# EasyEDA schematic BusRaider 2.01.json
TITLE: Bus Raider for RC2014; REV: 2.0; Date: 2019-10-06; Sheet: 1/1; Drawn By: robdobsn
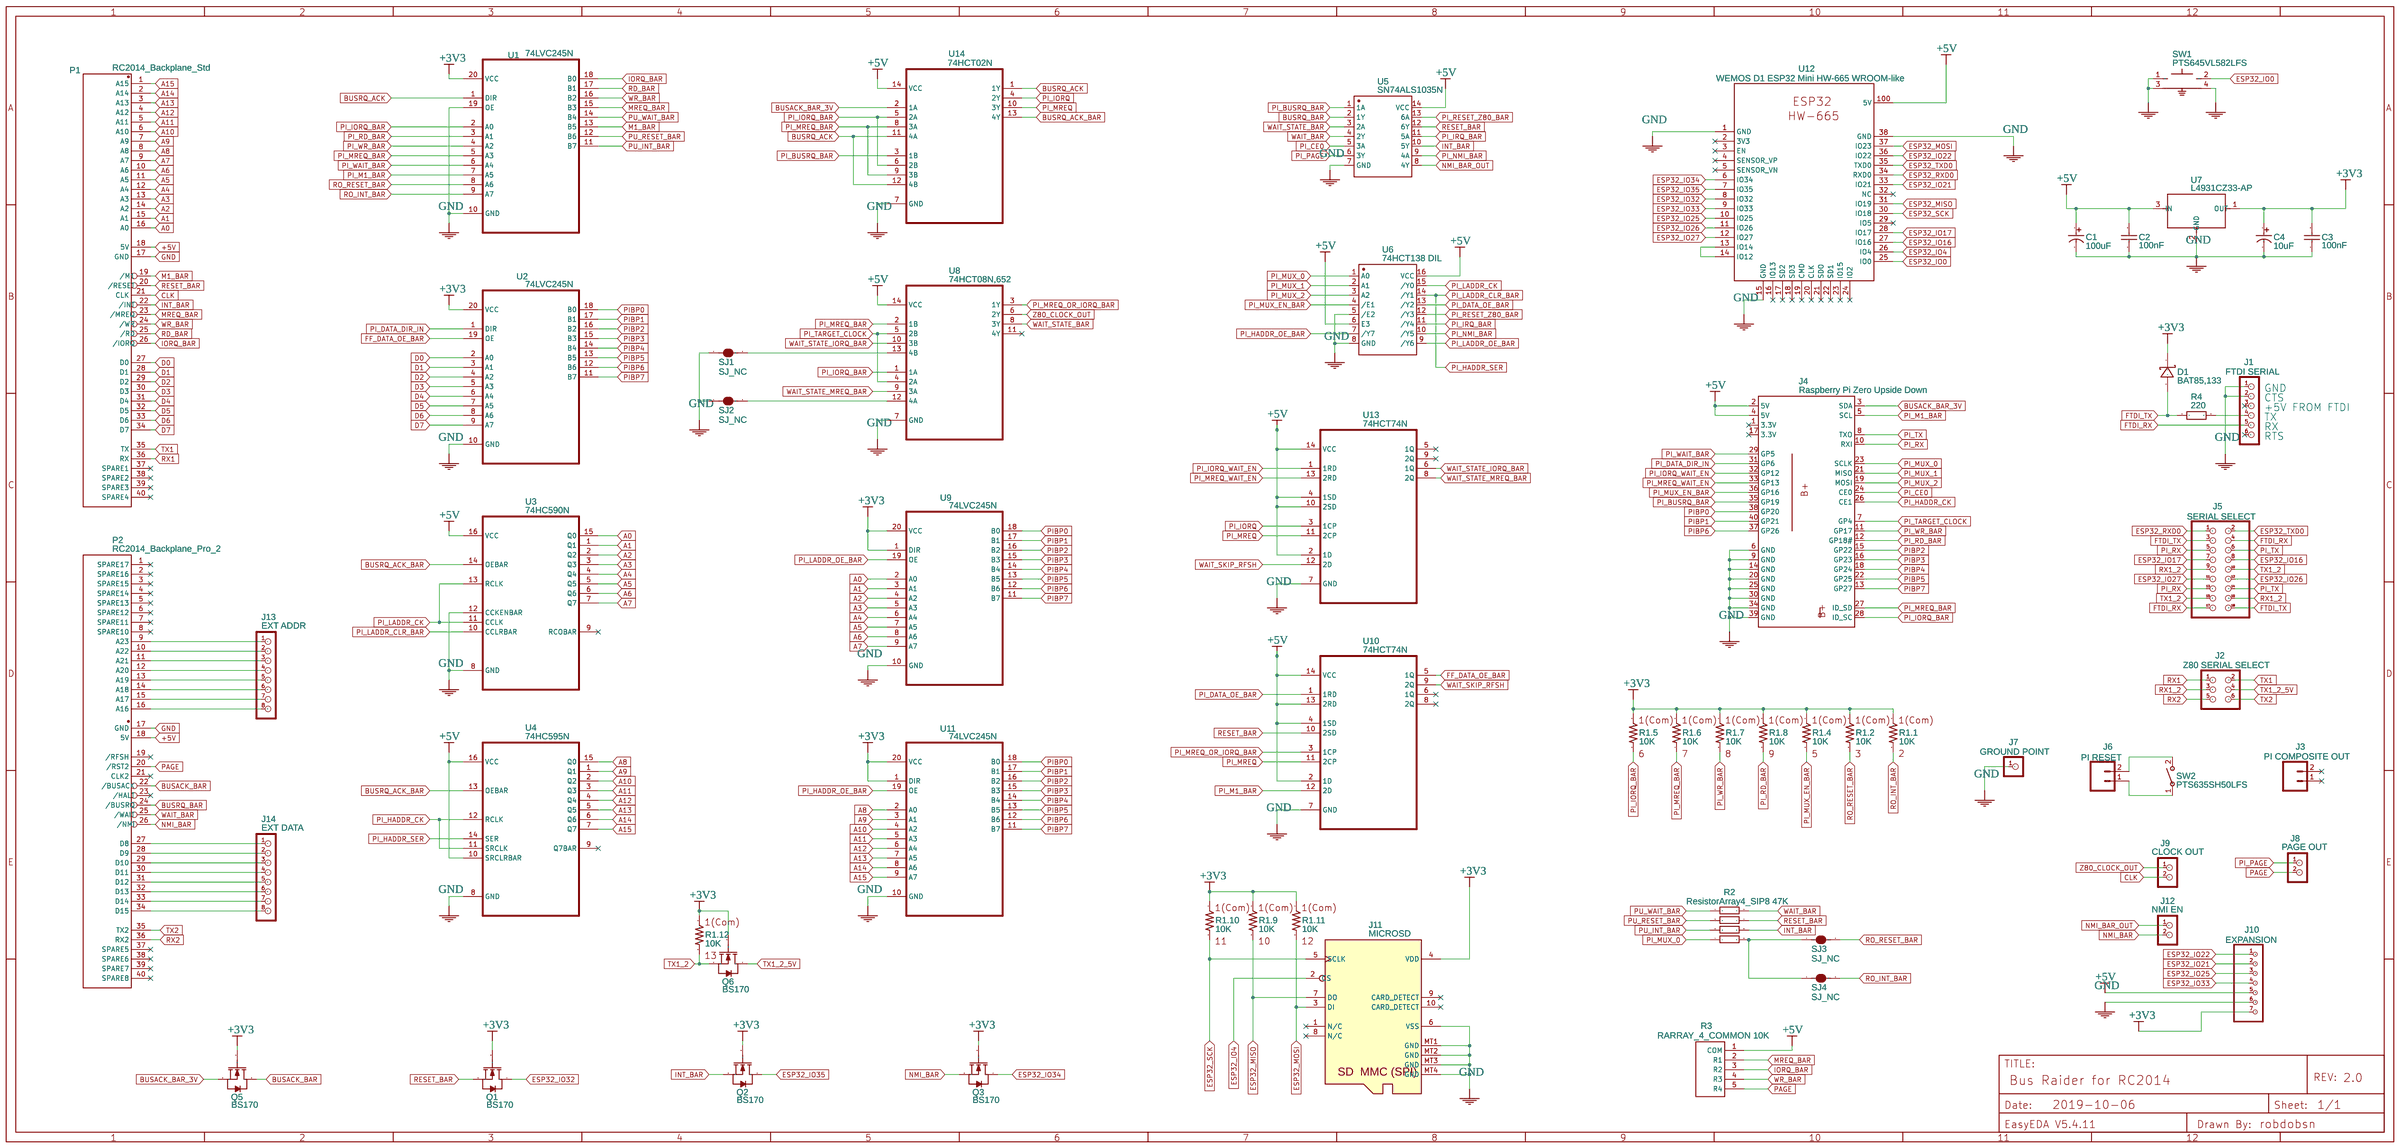
[diagram p0: schematic sheet]

## Parts
C1  100uF  [CAP-TH_BD5.0-P2.00-D0.8-FD]
C2  100nF  [PKG-CERAMIC CAPACITOR 6X2]
C3  100nF  [PKG-CERAMIC CAPACITOR 6X2]
C4  10uF  [CAP-TH_BD5.0-P2.00-D0.8-FD]
D1  BAT85,133  [DO-34-F]
J1  FTDI SERIAL  [M1X6]
J2  Z80 SERIAL SELECT  [2X03_NO_SILK]
J3  PI COMPOSITE OUT  [1X02_NO_SILK]
J4  Raspberry Pi Zero Upside Down  [PI_ZERO_UPSIDE_DOWN_3_HOLE_OPP]
J5  SERIAL SELECT  [2X09-CLEANBIG]
J6  PI RESET  [1X02_NO_SILK]
J7  GROUND POINT  [M1X2_10_17]
J8  PAGE OUT  [1X02_NO_SILK]
J9  CLOCK OUT  [1X02_NO_SILK]
J10  EXPANSION  [1X07_NO_SILK]
J11  MICROSD  [MOLEX SD-503398-003-2]
J12  NMI EN  [1X02_NO_SILK]
J13  EXT ADDR  [1X08_HEADER_2_54_THRU_NO_SILK]
J14  EXT DATA  [1X08_HEADER_2_54_THRU_NO_SILK]
P1  RC2014_Backplane_Std  [HDR-2.54-1X40P]
P2  RC2014_Backplane_Pro_2  [HDR-2.54-1X40P]
Q1  BS170  [TO-92]
Q2  BS170  [TO-92]
Q3  BS170  [TO-92]
Q5  BS170  [TO-92]
Q6  BS170  [TO-92]
R1  10K  [RESISTOR_ARRAY_SIP_13]  (sections 1,10,11,12,2,4,5,6,7,8,9)
R2  ResistorArray4_SIP8 47K  [RESISTOR_ARRAY_SIP_8]
R3  RARRAY_4_COMMON 10K  [RARRAY_4_COMMON]
R4  220  [AXIAL-3.2X1.8(1/8W)]
SJ1  SJ_NC  [SJ_NC]
SJ2  SJ_NC  [SJ_NC]
SJ3  SJ_NC  [SJ_NC]
SJ4  SJ_NC  [SJ_NC]
SW1  PTS645VL582LFS  [KEY-TOUCH-DIP-7.5*6.2*5.85]
SW2  PTS635SH50LFS  [KEY-6.0X3.5X3.5]
U1  74LVC245N  [DIP254P762X420-20]
U2  74LVC245N  [DIP254P762X420-20]
U3  74HC590N  [DIP254P762X508-16]
U4  74HC595N  [DIP254P762X508-16]
U5  SN74ALS1035N  [DIP254P762X420-14]
U6  74HCT138 DIL  [DIP254P762X508-16]
U7  L4931CZ33-AP  [TO-92]
U8  74HCT08N,652  [DIP254P762X420-14]
U9  74LVC245N  [DIP254P762X420-20]
U10  74HCT74N  [DIP254P762X420-14]
U11  74LVC245N  [DIP254P762X420-20]
U12  WEMOS D1 ESP32 Mini HW-665 WROOM-like  [WEMOS D1 ESP32]
U13  74HCT74N  [DIP254P762X420-14]
U14  74HCT02N  [DIP254P762X420-14]

## Library data of the parts
C1 C4 = 100uf/10V: Supplier: LCSC; Manufacturer: ValuePro; Supplier Part: C2035
C2 C3 = -: Voltage: 100V; Tolerance: ±20%; Supplier Part: 9411887; Supplier: Element14; Manufacturer Part: MCFYU6104Z6; Contributor: Prof. Ing. F. Scordino; Link: http://www.farnell.com/datasheets/296858.pdf?_ga=2.179112227.664711881.1510158588-238689616.1505921947&_gac=1.162203016.1510158588.EAIaIQobChMIqoD3jrOv1wIVgwrTCh2CCwl7EAAYASAAEgKQo_D_BwE
D1 = -: Supplier: LCSC; Manufacturer: Nexperia; Contributor: LCSC; Supplier Part: C134301
J1 J7 = -: Contributor: DangerousPrototype
J2 = -: Contributor: DangerousPrototype; sourceId: 5oAa8IGDB
J3 J6 = -: Standard 2-pin 0.1 header. Use with; Contributor: SparkFun
J4 = -: Raspberry Pi B+ GPIO Header; Contributor: robdobsn
J5 = -: PIN HEADER; Contributor: Adafruit
J8 J9 J12 = -: catid: 20; Contributor: DangerousPrototype; sourceId: t7e82kCUO; Manufacturer Part: ?
J10 J13 J14 R2 U5 = -: Contributor: robdobsn
J11 = -: Supplier: Digi-Key; Manufacturer: Molex; Manufacturer part: 5033981892; Manufacturer Part: ?; Supplier Part: WM11190CT-ND
P1 = -: Supplier Part: C74252; Supplier: LCSC; Contributor: robdobsn
P2 = -: Supplier Part: C74252; Contributor: robdobsn
Q1-Q3 Q5 Q6 = -: Supplier: LCSC; Manufacturer: FAIRCHILD; Supplier Part: C111691
R1 = -: Contributor: robdobsn; subpart_no: 12
R3 = -: Manufacturer Part: 4605X-AP1-103LF; Contributor: robdobsn; link: none; Supplier Part: 652-4605X-AP1-103LF; Manufacturer: Bourns
R4 = MF1/8W-160Ω±1% T52: Supplier: LCSC; Supplier Part: C119161; Manufacturer: Chian Chia Elec; Contributor: LCSC
SJ1-SJ4 = -: Solder Jumper; Contributor: robdobsn
SW1 = -: Supplier: LCSC; Supplier Part: C285524; Manufacturer: C&K; Contributor: LCSC
SW2 = -: Supplier: LCSC; Supplier Part: C221866; Manufacturer: C&K; Contributor: LCSC
U1 U2 U9 U11 = -: Octal bus transceiver; Contributor: robdobsn
U3 U4 = -: Octal counter 3 state; Contributor: robdobsn
U6 = -: Supplier Part: C86611; Supplier: LCSC; Manufacturer: FM; Manufacturer Part: 74HC138
U7 = -: DIP PMIC Voltage Regulators LDO 3.3V 250mA;; sourceId: MAoK6rNxT
U8 = -: Quad 2-input NAND gate; Contributor: robdobsn
U10 U13 = -: Dual D-type flip-flop with set and reset positive-edge trigger; Contributor: Guest
U12 = -: Manufacturer: WEMOS; Supplier: WEMOS; Supplier Part: WEMOS_D1_ESP32; Contributor: robdobsn
U14 = -: Quad 2-input NOR gate; Contributor: Guest

## Nets
+3V3: C3.2 C4.1 D1.1(K) J10.7 J11.4(VDD) Q1.2(G) Q2.2(G) Q3.2(G) Q5.2(G) Q6.2(G) R1.1 U1.20(VCC) U2.20(VCC) U7.1(OUT) U9.1(DIR) U9.20(VCC) U11.1(DIR) U11.20(VCC)
+5V: C1.1 C2.2 J4.2(5V) J4.4(5V) J10.5 P1.18(5V) P2.18(5V) R3.1(COM) U3.16(VCC) U4.10(SRCLRBAR) U4.16(VCC) U5.14(VCC) U6.6(E3) U6.16(VCC) U7.3(IN) U8.14(VCC) U10.2(1D) U10.4(1SD) U10.13(2RD) U10.14(VCC) U12.100(5V) U13.2(1D) U13.4(1SD) U13.10(2SD) U13.14(VCC) U14.14(VCC)
GND: C1.2 C2.1 C3.1 C4.2 J1.1 J1.2 J4.6(GND) J4.9(GND) J4.14(GND) J4.20(GND) J4.25(GND) J4.30(GND) J4.34(GND) J4.39(GND) J7.1 J10.6 J11.6(VSS) J11.MT1(GND) J11.MT2(GND) J11.MT3(GND) J11.MT4(GND) P1.17(GND) P2.17(GND) SJ1.1 SJ2.1 SW1.1 SW1.3 SW1.4 U1.10(GND) U1.19(OE) U2.10(GND) U3.8(GND) U3.12(CCKENBAR) U4.8(GND) U5.7(GND) U6.5(/E2) U6.8(GND) U7.2(GND) U8.7(GND) U9.10(GND) U10.7(GND) U11.10(GND) U12.1(GND) U12.15(GND) U12.38(GND) U13.7(GND) U14.7(GND)
A0: P1.16(A0) U3.15(Q0) U9.2(A0)
A1: P1.15(A1) U3.1(Q1) U9.3(A1)
A2: P1.14(A2) U3.2(Q2) U9.4(A2)
A3: P1.13(A3) U3.3(Q3) U9.5(A3)
A4: P1.12(A4) U3.4(Q4) U9.6(A4)
A5: P1.11(A5) U3.5(Q5) U9.7(A5)
A6: P1.10(A6) U3.6(Q6) U9.8(A6)
A7: P1.9(A7) U3.7(Q7) U9.9(A7)
A8: P1.8(A8) U4.15(Q0) U11.2(A0)
A9: P1.7(A9) U4.1(Q1) U11.3(A1)
A10: P1.6(A10) U4.2(Q2) U11.4(A2)
A11: P1.5(A11) U4.3(Q3) U11.5(A3)
A12: P1.4(A12) U4.4(Q4) U11.6(A4)
A13: P1.3(A13) U4.5(Q5) U11.7(A5)
A14: P1.2(A14) U4.6(Q6) U11.8(A6)
A15: P1.1(A15) U4.7(Q7) U11.9(A7)
BUSACK_BAR: P2.22(/BUSACK) Q5.1(D)
BUSACK_BAR_3V: J4.3(SDA) Q5.3(S) U14.2(1A)
BUSRQ_ACK: U1.1(DIR) U14.1(1Y) U14.11(4A) U14.12(4B)
BUSRQ_ACK_BAR: U3.14(OEBAR) U4.13(OEBAR) U14.13(4Y)
BUSRQ_BAR: P2.24(/BUSRQ) U5.2(1Y)
CLK: J9.2 P1.21(CLK)
D0: P1.27(D0) U2.2(A0)
D1: P1.28(D1) U2.3(A1)
D2: P1.29(D2) U2.4(A2)
D3: P1.30(D3) U2.5(A3)
D4: P1.31(D4) U2.6(A4)
D5: P1.32(D5) U2.7(A5)
D6: P1.33(D6) U2.8(A6)
D7: P1.34(D7) U2.9(A7)
ESP32_IO0: SW1.2 U12.25(IO0)
ESP32_IO4: J11.2(CS) U12.26(IO4)
ESP32_IO16: J5.8 U12.27(IO16)
ESP32_IO17: J5.7 U12.28(IO17)
ESP32_IO21: J10.2 U12.33(IO21)
ESP32_IO22: J10.1 U12.36(IO22)
ESP32_IO25: J10.3 U12.10(IO25)
ESP32_IO26: J5.12 U12.11(IO26)
ESP32_IO27: J5.11 U12.12(IO27)
ESP32_IO32: Q1.1(D) U12.8(IO32)
ESP32_IO33: J10.4 U12.9(IO33)
ESP32_IO34: Q3.1(D) U12.6(IO34)
ESP32_IO35: Q2.1(D) U12.7(IO35)
ESP32_MISO: J11.7(DO) R1.10 U12.31(IO19)
ESP32_MOSI: J11.3(DI) R1.12 U12.37(IO23)
ESP32_RXD0: J5.1 U12.34(RXD0)
ESP32_SCK: J11.5(SCLK) R1.11 U12.30(IO18)
ESP32_TXD0: J5.2 U12.35(TXD0)
FF_DATA_OE_BAR: U2.19(OE) U10.5(1Q)
FTDI_RX: J1.5 J5.4 J5.17
FTDI_TX: D1.2(A) J5.3 J5.18 R4.1
INT_BAR: P1.22(/INT) Q2.3(S) R2.6 U5.10(5Y)
IORQ_BAR: P1.26(/IORQ) R3.3(R2) U1.18(B0)
M1_BAR: P1.19(/M1) U1.13(B5)
MREQ_BAR: P1.23(/MREQ) R3.2(R1) U1.15(B3)
NMI_BAR: J12.2 P2.26(/NMI) Q3.3(S)
NMI_BAR_OUT: J12.1 U5.8(4Y)
PAGE: J8.2 P2.20(/RST2) R3.5(R4)
PI_BUSRQ_BAR: J4.35(GP19) U5.1(1A) U14.3(1B)
PI_CE0: J4.24(CE0) U5.5(3A)
PI_DATA_DIR_IN: J4.31(GP6) U2.1(DIR)
PI_DATA_OE_BAR: U6.13(/Y2) U10.1(1RD)
PI_HADDR_CK: J4.26(CE1) U4.11(SRCLK) U4.12(RCLK)
PI_HADDR_OE_BAR: U6.7(/Y7) U11.19(OE)
PI_HADDR_SER: U3.10(CCLRBAR) U4.14(SER) U6.14(/Y1)
PI_IORQ: U13.3(1CP) U14.4(2Y)
PI_IORQ_BAR: J4.28(ID_SC) R1.6 U1.2(A0) U8.1(1A) U14.5(2A) U14.6(2B)
PI_IORQ_WAIT_EN: J4.32(GP12) U13.1(1RD)
PI_IRQ_BAR: U5.11(5A) U6.11(/Y4)
PI_LADDR_CK: U3.11(CCLK) U3.13(RCLK) U6.15(/Y0)
PI_LADDR_OE_BAR: U6.9(/Y6) U9.19(OE)
PI_M1_BAR: J4.5(SCL) U1.7(A5) U10.12(2D)
PI_MREQ: U10.11(2CP) U13.11(2CP) U14.10(3Y)
PI_MREQ_BAR: J4.27(ID_SD) R1.7 U1.5(A3) U8.2(1B) U14.8(3A) U14.9(3B)
PI_MREQ_OR_IORQ_BAR: U8.3(1Y) U10.3(1CP)
PI_MREQ_WAIT_EN: J4.33(GP13) U13.13(2RD)
PI_MUX_0: J4.23(SCLK) R2.7 U6.1(A0)
PI_MUX_1: J4.21(MISO) U6.2(A1)
PI_MUX_2: J4.19(MOSI) U6.3(A2)
PI_MUX_EN_BAR: J4.36(GP16) R1.5 U6.4(/E1)
PI_NMI_BAR: U5.9(4A) U6.10(/Y5)
PI_PAGE: J8.1 U5.6(3Y)
PI_RD_BAR: J4.12(GP18#) R1.9 U1.3(A1)
PI_RESET_Z80_BAR: U5.13(6A) U6.12(/Y3)
PI_RX: J4.10(RXI) J5.5 J5.13
PI_TARGET_CLOCK: J4.7(GP4) U8.4(2A) U8.5(2B)
PI_TX: J4.8(TXO) J5.6 J5.14
PI_WAIT_BAR: J4.29(GP5) U1.6(A4)
PI_WR_BAR: J4.11(GP17) R1.8 U1.4(A2)
PIBP0: J4.38(GP20) U2.18(B0) U9.18(B0) U11.18(B0)
PIBP1: J4.40(GP21) U2.17(B1) U9.17(B1) U11.17(B1)
PIBP2: J4.15(GP22) U2.16(B2) U9.16(B2) U11.16(B2)
PIBP3: J4.16(GP23) U2.15(B3) U9.15(B3) U11.15(B3)
PIBP4: J4.18(GP24) U2.14(B4) U9.14(B4) U11.14(B4)
PIBP5: J4.22(GP25) U2.13(B5) U9.13(B5) U11.13(B5)
PIBP6: J4.37(GP26) U2.12(B6) U9.12(B6) U11.12(B6)
PIBP7: J4.13(GP27) U2.11(B7) U9.11(B7) U11.11(B7)
PU_INT_BAR: R2.5 U1.11(B7)
PU_RESET_BAR: R2.3 U1.12(B6)
PU_WAIT_BAR: R2.1 U1.14(B4)
RD_BAR: P1.25(/RD) U1.17(B1)
RESET_BAR: P1.20(/RESET) Q1.3(S) R2.4 U5.12(6Y) U10.10(2SD)
RO_INT_BAR: R1.2 SJ4.2 U1.9(A7)
RO_RESET_BAR: R1.3 SJ3.2 U1.8(A6)
RX1: J2.1 P1.36(RX)
RX1_2: J2.3 J5.9 J5.16
RX2: J2.5 P2.36(RX2)
TX1: J2.2 P1.35(TX)
TX1_2: J5.10 J5.15 Q6.3(S) R1.13
TX1_2_5V: J2.4 Q6.1(D)
TX2: J2.6 P2.35(TX2)
WAIT_BAR: P2.25(/WAIT) R2.2 U5.4(2Y)
WAIT_SKIP_RFSH: U10.9(2Q) U13.12(2D)
WAIT_STATE_BAR: U5.3(2A) U8.8(3Y)
WAIT_STATE_IORQ_BAR: U8.10(3B) U13.6(1Q)
WAIT_STATE_MREQ_BAR: U8.9(3A) U13.8(2Q)
WR_BAR: P1.24(/WR) R3.4(R3) U1.16(B2)
Z80_CLOCK_OUT: J9.1 U8.6(2Y)
Net-(J1-4): J1.4 R4.2
Net-(J6-1): J6.1 SW2.1
Net-(J6-2): J6.2 SW2.2
Net-(J13-1): J13.1 P2.9(A23)
Net-(J13-2): J13.2 P2.10(A22)
Net-(J13-3): J13.3 P2.11(A21)
Net-(J13-4): J13.4 P2.12(A20)
Net-(J13-5): J13.5 P2.13(A19)
Net-(J13-6): J13.6 P2.14(A18)
Net-(J13-7): J13.7 P2.15(A17)
Net-(J13-8): J13.8 P2.16(A16)
Net-(J14-1): J14.1 P2.27(D8)
Net-(J14-2): J14.2 P2.28(D9)
Net-(J14-3): J14.3 P2.29(D10)
Net-(J14-4): J14.4 P2.30(D11)
Net-(J14-5): J14.5 P2.31(D12)
Net-(J14-6): J14.6 P2.32(D13)
Net-(J14-7): J14.7 P2.33(D14)
Net-(J14-8): J14.8 P2.34(D15)
Net-(R2-8): R2.8 SJ3.1 SJ4.1
Net-(SJ1-2): SJ1.2 U8.13(4B)
Net-(SJ2-2): SJ2.2 U8.12(4A)
Net-(U12-13): U12.13(IO14) U12.14(IO12)

Not connected (* = marked no-connect by the designer): J1 3* 6*; J3 1* 2*; J4 1(3.3V)* 17(3.3V)*; J11 1(N/C)* 8(N/C)* 9(CARD_DETECT)* 10(CARD_DETECT)*; P1 37(SPARE1)* 38(SPARE2)* 39(SPARE3)* 40(SPARE4)*; P2 1(SPARE17)* 2(SPARE16)* 3(SPARE15)* 4(SPARE14)* 5(SPARE13)* 6(SPARE12)* 7(SPARE11)* 8(SPARE10)* 19(/RFSH)* 21(CLK2)* 23(/HALT)* 37(SPARE5)* 38(SPARE6)* 39(SPARE7)* 40(SPARE8)*; U3 9(RCOBAR)*; U4 9(Q7BAR)*; U8 11(4Y)*; U10 6(1Q)* 8(2Q)*; U12 2(3V3)* 3(EN)* 4(SENSOR_VP)* 5(SENSOR_VN)* 16(IO13)* 17(SD2)* 18(SD3)* 19(CMD)* 20(CLK)* 21(SDO)* 22(SD1)* 23(IO15)* 24(IO2)* 29(IO5)* 32(NC)*; U13 5(1Q)* 9(2Q)*

## Notes on the sheet
- GND
- CTS
- +5V FROM FTDI
- TX
- RX
- RTS
